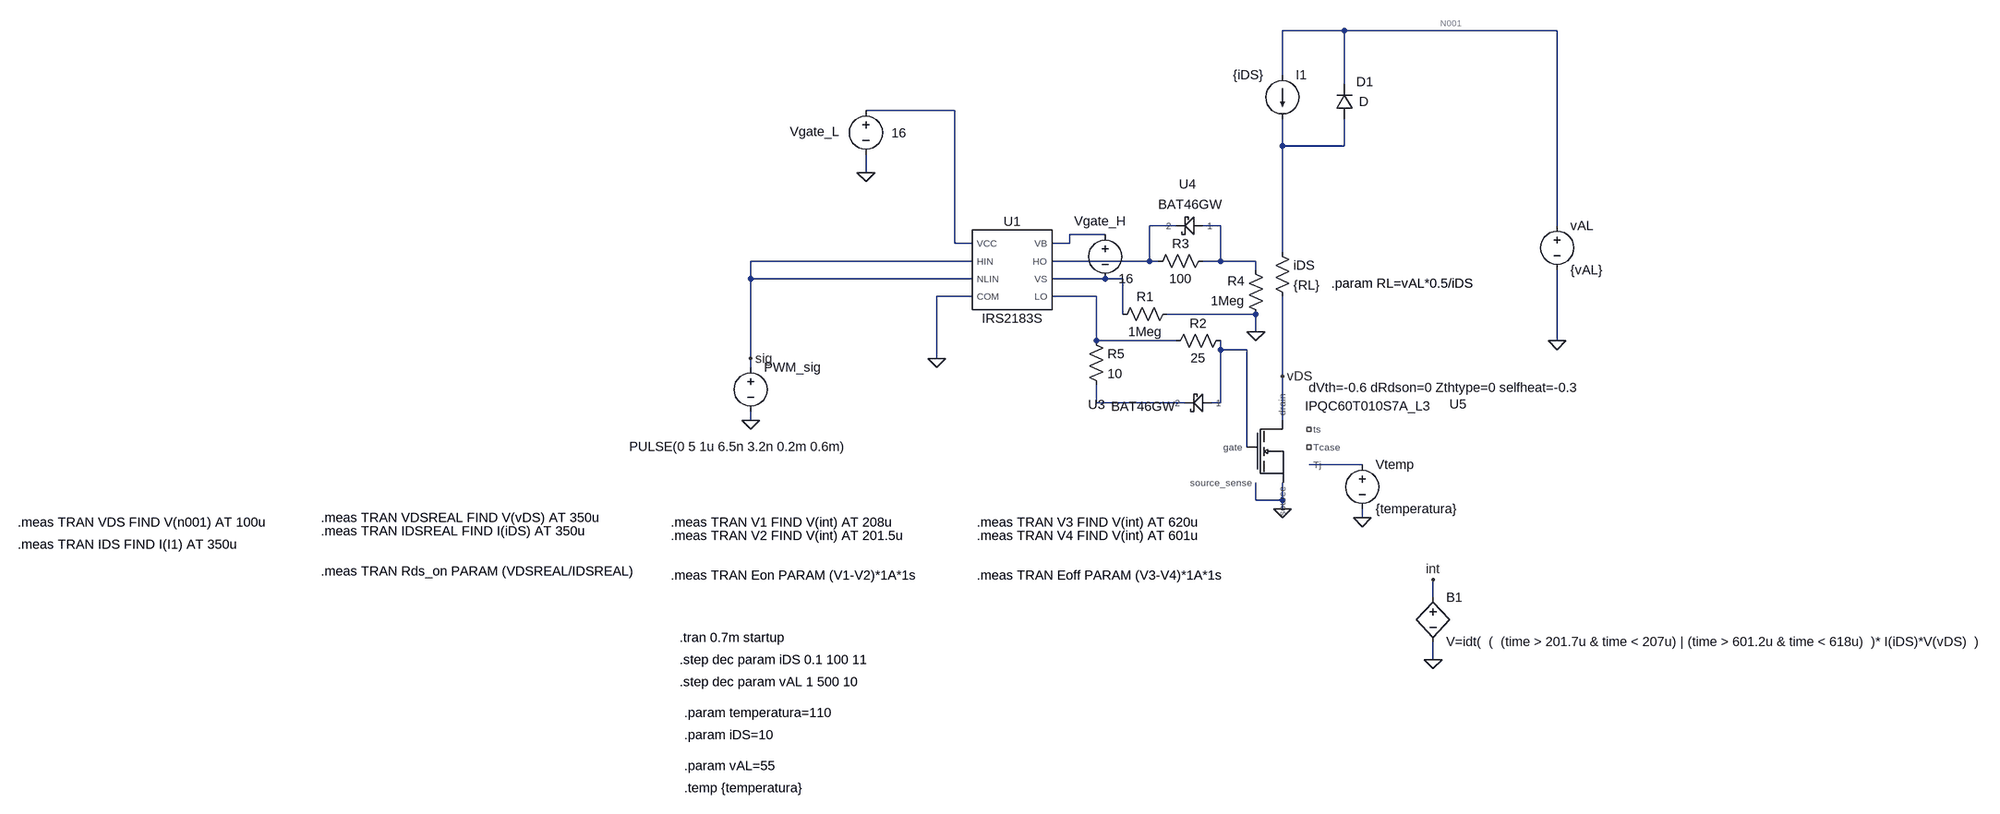
[diagram p0: schematic Eon_Eoff_circuit.asc]
Eon_Eoff_circuit.asc, the LTspice schematic file:
Version 4.1
SHEET 1 2024 1128
WIRE 704 -256 592 -256
WIRE 1088 -256 704 -256
WIRE 592 -176 592 -256
WIRE 704 -160 704 -256
WIRE 0 -112 -160 -112
WIRE 592 -48 592 -96
WIRE 704 -48 704 -96
WIRE 704 -48 592 -48
WIRE -160 0 -160 -32
WIRE 400 96 352 96
WIRE 480 96 448 96
WIRE 1088 96 1088 -256
WIRE 272 112 208 112
WIRE 0 128 0 -112
WIRE 32 128 0 128
WIRE 208 128 208 112
WIRE 208 128 176 128
WIRE 592 144 592 -48
WIRE 32 160 -368 160
WIRE 352 160 352 96
WIRE 352 160 176 160
WIRE 368 160 352 160
WIRE 480 160 480 96
WIRE 480 160 448 160
WIRE 544 160 480 160
WIRE 544 176 544 160
WIRE -368 192 -368 160
WIRE 32 192 -368 192
WIRE 272 192 176 192
WIRE 304 192 272 192
WIRE 32 224 -32 224
WIRE 256 224 176 224
WIRE 304 256 304 192
WIRE 544 256 384 256
WIRE 544 288 544 256
WIRE 256 304 256 224
WIRE 400 304 256 304
WIRE 1088 304 1088 176
WIRE 480 320 480 304
WIRE 528 320 480 320
WIRE -368 336 -368 192
WIRE -32 336 -32 224
WIRE -368 352 -368 336
WIRE 592 368 592 224
WIRE 256 416 256 384
WIRE 416 416 256 416
WIRE 480 416 480 320
WIRE 480 416 464 416
WIRE -368 448 -368 432
WIRE 592 448 592 368
WIRE 528 496 528 320
WIRE 736 528 640 528
WIRE 544 592 544 560
WIRE 592 592 592 560
WIRE 592 592 544 592
WIRE 592 608 592 592
WIRE 736 624 736 608
WIRE 864 768 864 736
WIRE 864 880 864 848
FLAG -160 0 0
FLAG -368 448 0
FLAG -32 336 0
FLAG -368 336 sig
FLAG 1088 304 0
FLAG 864 880 0
FLAG 864 736 int
FLAG 592 608 0
FLAG 544 288 0
FLAG 592 368 vDS
FLAG 736 624 0
SYMBOL voltage -368 336 R0
WINDOW 3 -219 159 Left 2
WINDOW 123 0 0 Left 0
WINDOW 39 0 0 Left 0
SYMATTR Value PULSE(0 5 1u 6.5n 3.2n 0.2m 0.6m)
SYMATTR InstName PWM_sig
SYMBOL voltage -160 -128 R0
WINDOW 123 0 0 Left 0
WINDOW 39 0 0 Left 0
WINDOW 0 -137 54 Left 2
WINDOW 3 46 57 Left 2
SYMATTR InstName Vgate_L
SYMATTR Value 16
SYMBOL IRS2183S 96 176 R0
SYMATTR InstName U1
SYMBOL voltage 1088 80 R0
WINDOW 123 0 0 Left 0
WINDOW 39 0 0 Left 0
SYMATTR InstName vAL
SYMATTR Value {vAL}
SYMBOL res 496 288 R90
WINDOW 0 0 56 VBottom 2
WINDOW 3 32 56 VTop 2
SYMATTR InstName R2
SYMATTR Value 25
SYMBOL res 464 144 R90
WINDOW 0 0 56 VBottom 2
WINDOW 3 32 56 VTop 2
SYMATTR InstName R3
SYMATTR Value 100
SYMBOL voltage 272 96 R0
WINDOW 123 0 0 Left 0
WINDOW 39 0 0 Left 0
WINDOW 0 -56 -8 Left 2
SYMATTR InstName Vgate_H
SYMATTR Value 16
SYMBOL bv 864 752 R0
SYMATTR InstName B1
SYMATTR Value V=idt(  (  (time > 201.7u & time < 207u) | (time > 601.2u & time < 618u)  )* I(iDS)*V(vDS)  )
SYMBOL BAT46GW 448 416 R0
WINDOW 0 -191 19 Bottom 2
WINDOW 3 -108 -9 Top 2
SYMATTR InstName U3
SYMBOL BAT46GW 432 96 R0
WINDOW 0 -11 -59 Bottom 2
WINDOW 3 -7 -54 Top 2
SYMATTR InstName U4
SYMBOL res 400 240 R90
WINDOW 0 0 56 VBottom 2
WINDOW 3 32 56 VTop 2
SYMATTR InstName R1
SYMATTR Value 1Meg
SYMBOL res 576 128 R0
SYMATTR InstName iDS
SYMATTR Value {RL}
SYMBOL res 560 272 R180
WINDOW 0 36 76 Left 2
WINDOW 3 36 40 Left 2
SYMATTR InstName R4
SYMATTR Value 1Meg
SYMBOL current 592 -176 R0
WINDOW 3 -89 0 Left 2
SYMATTR Value {iDS}
SYMATTR InstName I1
SYMBOL diode 720 -96 R180
WINDOW 0 -36 68 Left 2
WINDOW 3 -28 32 Left 2
SYMATTR InstName D1
SYMBOL IPQC60T010S7_L3 592 512 R0
WINDOW 0 317 -78 Bottom 2
WINDOW 39 291 -139 Top 2
SYMATTR InstName U5
SYMATTR SpiceLine dVth=-0.6 dRdson=0 Zthtype=0 selfheat=-0.3
SYMBOL voltage 736 512 R0
SYMATTR InstName Vtemp
SYMATTR Value {temperatura}
SYMBOL res 240 288 R0
SYMATTR InstName R5
SYMATTR Value 10
TEXT -496 840 Left 2 !.tran 0.7m startup
TEXT -512 728 Left 2 !.meas TRAN Eon PARAM (V1-V2)*1A*1s
TEXT -512 632 Left 2 !.meas TRAN V1 FIND V(int) AT 208u
TEXT -512 656 Left 2 !.meas TRAN V2 FIND V(int) AT 201.5u
TEXT 40 632 Left 2 !.meas TRAN V3 FIND V(int) AT 620u
TEXT 40 656 Left 2 !.meas TRAN V4 FIND V(int) AT 601u
TEXT 40 728 Left 2 !.meas TRAN Eoff PARAM (V3-V4)*1A*1s
TEXT -496 880 Left 2 !.step dec param iDS 0.1 100 11
TEXT -496 920 Left 2 !.step dec param vAL 1 500 10
TEXT -488 1016 Left 2 !.param iDS=10
TEXT -488 1072 Left 2 !.param vAL=55
TEXT 680 200 Left 2 !.param RL=vAL*0.5/iDS
TEXT -1144 648 Left 2 !.meas TRAN IDSREAL FIND I(iDS) AT 350u
TEXT -1144 624 Left 2 !.meas TRAN VDSREAL FIND V(vDS) AT 350u
TEXT -1144 720 Left 2 !.meas TRAN Rds_on PARAM (VDSREAL/IDSREAL)
TEXT -1728 632 Left 2 !.meas TRAN VDS FIND V(n001) AT 100u
TEXT -1728 672 Left 2 !.meas TRAN IDS FIND I(I1) AT 350u
TEXT -488 1112 Left 2 !.temp {temperatura}
TEXT -488 976 Left 2 !.param temperatura=110

The netlist it stands for:
* Eon_Eoff_circuit.asc
V§PWM_sig sig 0 PULSE(0 5 1u 6.5n 3.2n 0.2m 0.6m)
Vgate_L N002 0 16
X§U1 N008 N004 0 sig sig N002 N006 N007 IRS2183S  ; pins LO HO COM HIN NLIN VCC VB VS
vAL N001 0 {vAL}
R2 N009 N008 25
R3 N005 N004 100
Vgate_H N006 N007 16
B1 int 0 V=idt(  (  (time > 201.7u & time < 207u) | (time > 601.2u & time < 618u)  )* I(iDS)*V(vDS)  )
X§U3 N009 N010 BAT46GW  ; pins 1 2
X§U4 N005 N004 BAT46GW  ; pins 1 2
R1 0 N007 1Meg
R§iDS N003 vDS {RL}
R4 0 N005 1Meg
I1 N001 N003 {iDS}
D1 N003 N001 D
X§U5 vDS N009 0 0 NC_01 N011 NC_02 IPQC60T010S7A_L3 dVth=-0.6 dRdson=0 Zthtype=0 selfheat=-0.3  ; pins drain gate source source_sense ts Tj Tcase
Vtemp N011 0 {temperatura}
R5 N008 N010 10
.model D D
.lib standard.dio
.tran 0.7m startup
.meas TRAN Eon PARAM (V1-V2)*1A*1s
.meas TRAN V1 FIND V(int) AT 208u
.meas TRAN V2 FIND V(int) AT 201.5u
.meas TRAN V3 FIND V(int) AT 620u
.meas TRAN V4 FIND V(int) AT 601u
.meas TRAN Eoff PARAM (V3-V4)*1A*1s
.step dec param iDS 0.1 100 11
.step dec param vAL 1 500 10
.param iDS=10
.param vAL=55
.param RL=vAL*0.5/iDS
.meas TRAN IDSREAL FIND I(iDS) AT 350u
.meas TRAN VDSREAL FIND V(vDS) AT 350u
.meas TRAN Rds_on PARAM (VDSREAL/IDSREAL)
.meas TRAN VDS FIND V(n001) AT 100u
.meas TRAN IDS FIND I(I1) AT 350u
.temp {temperatura}
.param temperatura=110
.lib IRS2183S.lib
.lib BAT46GW.lib
.lib IFX_S7A_TS_600V.lib
.backanno
.end